# EAGLE schematic Ausgangsverstärker_50_Ohm (EAGLE 7.5.0)
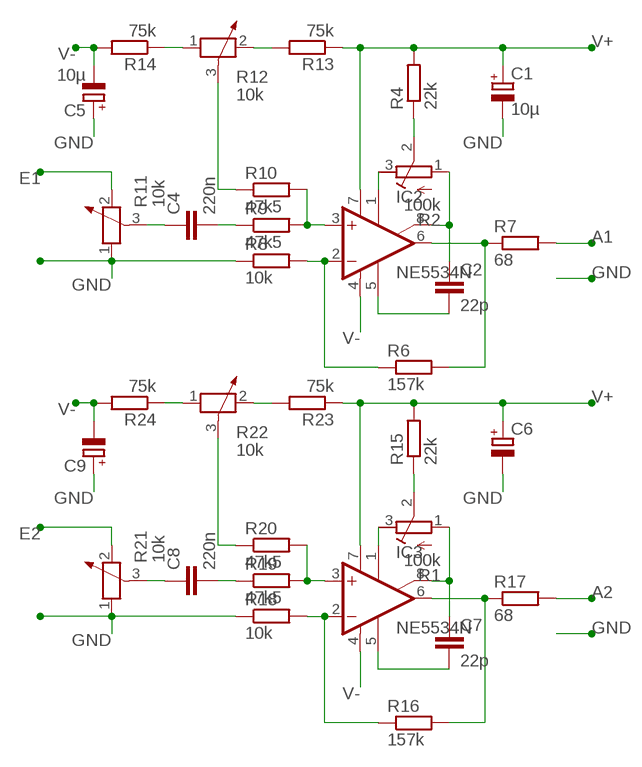
[diagram p0: schematic, sheet 1]

## Parts
C1  10µ  CPOL-EUE2-5  [E2-5]
C2  22p  C-EU050-024X044  [C050-024X044]
C4  220n  C-EU050-024X044  [C050-024X044]
C5  10µ  CPOL-EUE2-5  [E2-5]
C6  CPOL-EUE2-5  [E2-5]
C7  22p  C-EU050-024X044  [C050-024X044]
C8  220n  C-EU050-024X044  [C050-024X044]
C9  CPOL-EUE2-5  [E2-5]
IC2  NE5534N  [DIL08]
IC3  NE5534N  [DIL08]
R1  100k  R-TRIMM64W  [RTRIM64W]
R2  100k  R-TRIMM64W  [RTRIM64W]
R4  22k  R-EU_0207/12  [0207/12]
R6  157k  R-EU_0207/12  [0207/12]
R7  68  R-EU_0207/12  [0207/12]
R8  10k  R-EU_0207/12  [0207/12]
R9  47k5  R-EU_0207/12  [0207/12]
R10  47k5  R-EU_0207/12  [0207/12]
R11  10k  POTENTIOMETER_PT-10  [PT-10]
R12  10k  POTENTIOMETER_PT-10  [PT-10]
R13  75k  R-EU_0207/12  [0207/12]
R14  75k  R-EU_0207/12  [0207/12]
R15  22k  R-EU_0207/12  [0207/12]
R16  157k  R-EU_0207/12  [0207/12]
R17  68  R-EU_0207/12  [0207/12]
R18  10k  R-EU_0207/12  [0207/12]
R19  47k5  R-EU_0207/12  [0207/12]
R20  47k5  R-EU_0207/12  [0207/12]
R21  10k  POTENTIOMETER_PT-10  [PT-10]
R22  10k  POTENTIOMETER_PT-10  [PT-10]
R23  75k  R-EU_0207/12  [0207/12]
R24  75k  R-EU_0207/12  [0207/12]

## Nets
A1: R7.2
A2: R17.2
E1: R11.2
E2: R21.2
GND: C1.- C5.+ C6.- C9.+ R8.1 R11.1 R18.1 R21.1
N$1: R2.2(S) R4.1
N$2: IC2.1(ON) R2.3(E)
N$3: C2.1 IC2.8(ON/CMP) R2.1(A)
N$4: C2.2 IC2.5(CMP)
N$9: IC2.3(+IN) R9.2 R10.2
N$10: C4.2 R9.1
N$11: R10.1 R12.3
N$12: IC2.2(-IN) R6.1 R8.2
N$13: C4.1 R11.3
N$14: IC2.6(OUT) R6.2 R7.1
N$15: R12.2 R13.2
N$16: R1.2(S) R15.1
N$17: C7.1 IC3.8(ON/CMP) R1.1(A)
N$18: R12.1 R14.1
N$19: C7.2 IC3.5(CMP)
N$20: IC3.1(ON) R1.3(E)
N$21: IC3.3(+IN) R19.2 R20.2
N$22: C8.2 R19.1
N$23: R20.1 R22.3
N$24: IC3.2(-IN) R16.1 R18.2
N$25: IC3.6(OUT) R16.2 R17.1
N$26: R22.2 R23.2
N$27: R22.1 R24.1
N$28: C8.1 R21.3
V+: C1.+ C6.+ IC2.7(V+) IC3.7(V+) R4.2 R13.1 R15.2 R23.1
V-: C5.- C9.- IC2.4(V-) IC3.4(V-) R14.2 R24.2

## Library data of the parts
C1 C5 C6 C9 = rcl:CPOL-EU: POLARIZED CAPACITOR, European symbol
C2 C4 C7 C8 = rcl:C-EU: CAPACITOR, European symbol
IC2 IC3 = linear:NE5534: LOW-NOISE OPERATIONAL AMPLIFIER Source: http://focus.ti.com/lit/ds/symlink/ne5534.pdf
R1 R2 = rcl:R-TRIMM: Trimm resistor
R4 R6-R10 R13-R20 R23 R24 = rcl:R-EU_: RESISTOR, European symbol
R11 R12 R21 R22 = rcl:POTENTIOMETER_: Potentiometer